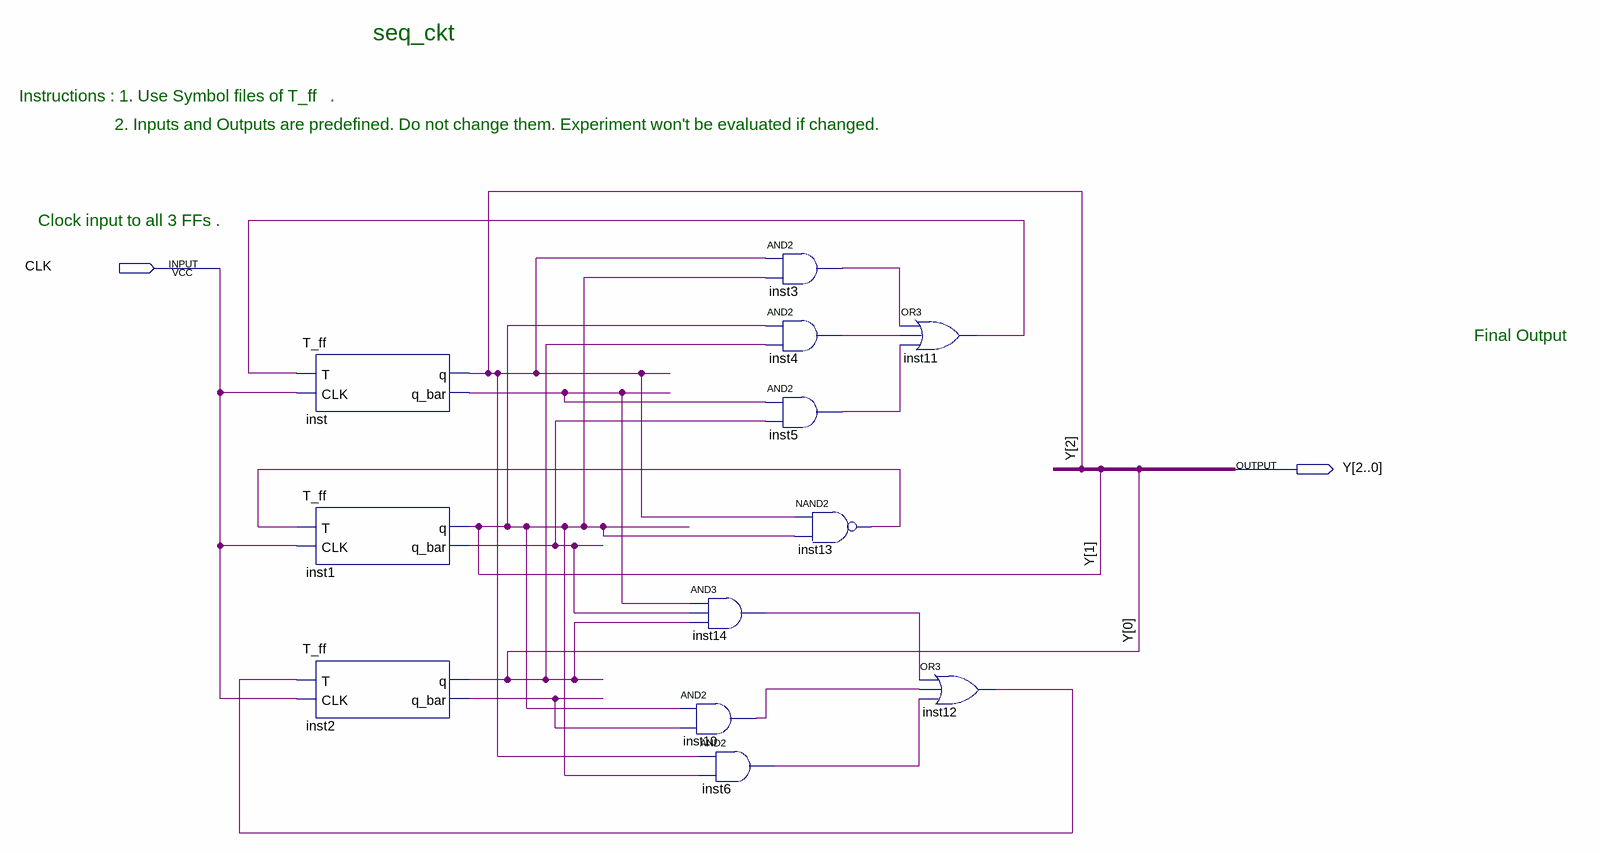
[diagram p0: schematic sheet]
// Quartus schematic seq_block.bdf as structural Verilog: 12 symbols, 2 pins
module seq_block (
  input  CLK,
  output [2:0] Y
);

  wire inst1_q_bar, inst2_q_bar, inst3_out, inst4_out, inst5_out, inst6_out, inst10_out, inst11_out,
       inst12_out, inst13_out, inst14_out, inst_q_bar;

  T_ff inst (.T(inst11_out), .CLK(CLK), .q(Y[2]), .q_bar(inst_q_bar));
  T_ff inst1 (.T(inst13_out), .CLK(CLK), .q(Y[1]), .q_bar(inst1_q_bar));
  T_ff inst2 (.T(inst12_out), .CLK(CLK), .q(Y[0]), .q_bar(inst2_q_bar));
  and inst14 (inst14_out, inst_q_bar, inst1_q_bar, Y[0]);
  and inst10 (inst10_out, Y[1], inst2_q_bar);
  and inst6 (inst6_out, Y[2], Y[1]);
  and inst3 (inst3_out, Y[2], Y[1]);
  and inst4 (inst4_out, Y[1], Y[0]);
  and inst5 (inst5_out, inst_q_bar, inst1_q_bar);
  nand inst13 (inst13_out, Y[2], Y[1]);
  or inst11 (inst11_out, inst3_out, inst4_out, inst5_out);
  or inst12 (inst12_out, inst14_out, inst10_out, inst6_out);

  // Notes on the sheet:
  //   seq_ckt
  //   Instructions : 1. Use Symbol files of T_ff   . 
  //   2. Inputs and Outputs are predefined. Do not change them. Experiment won't be evaluated if changed.
  //   Clock input to all 3 FFs .
  //   Final Output
endmodule
